# EAGLE design McPiFace-60mmFan-V2 (EAGLE 7.4.0)
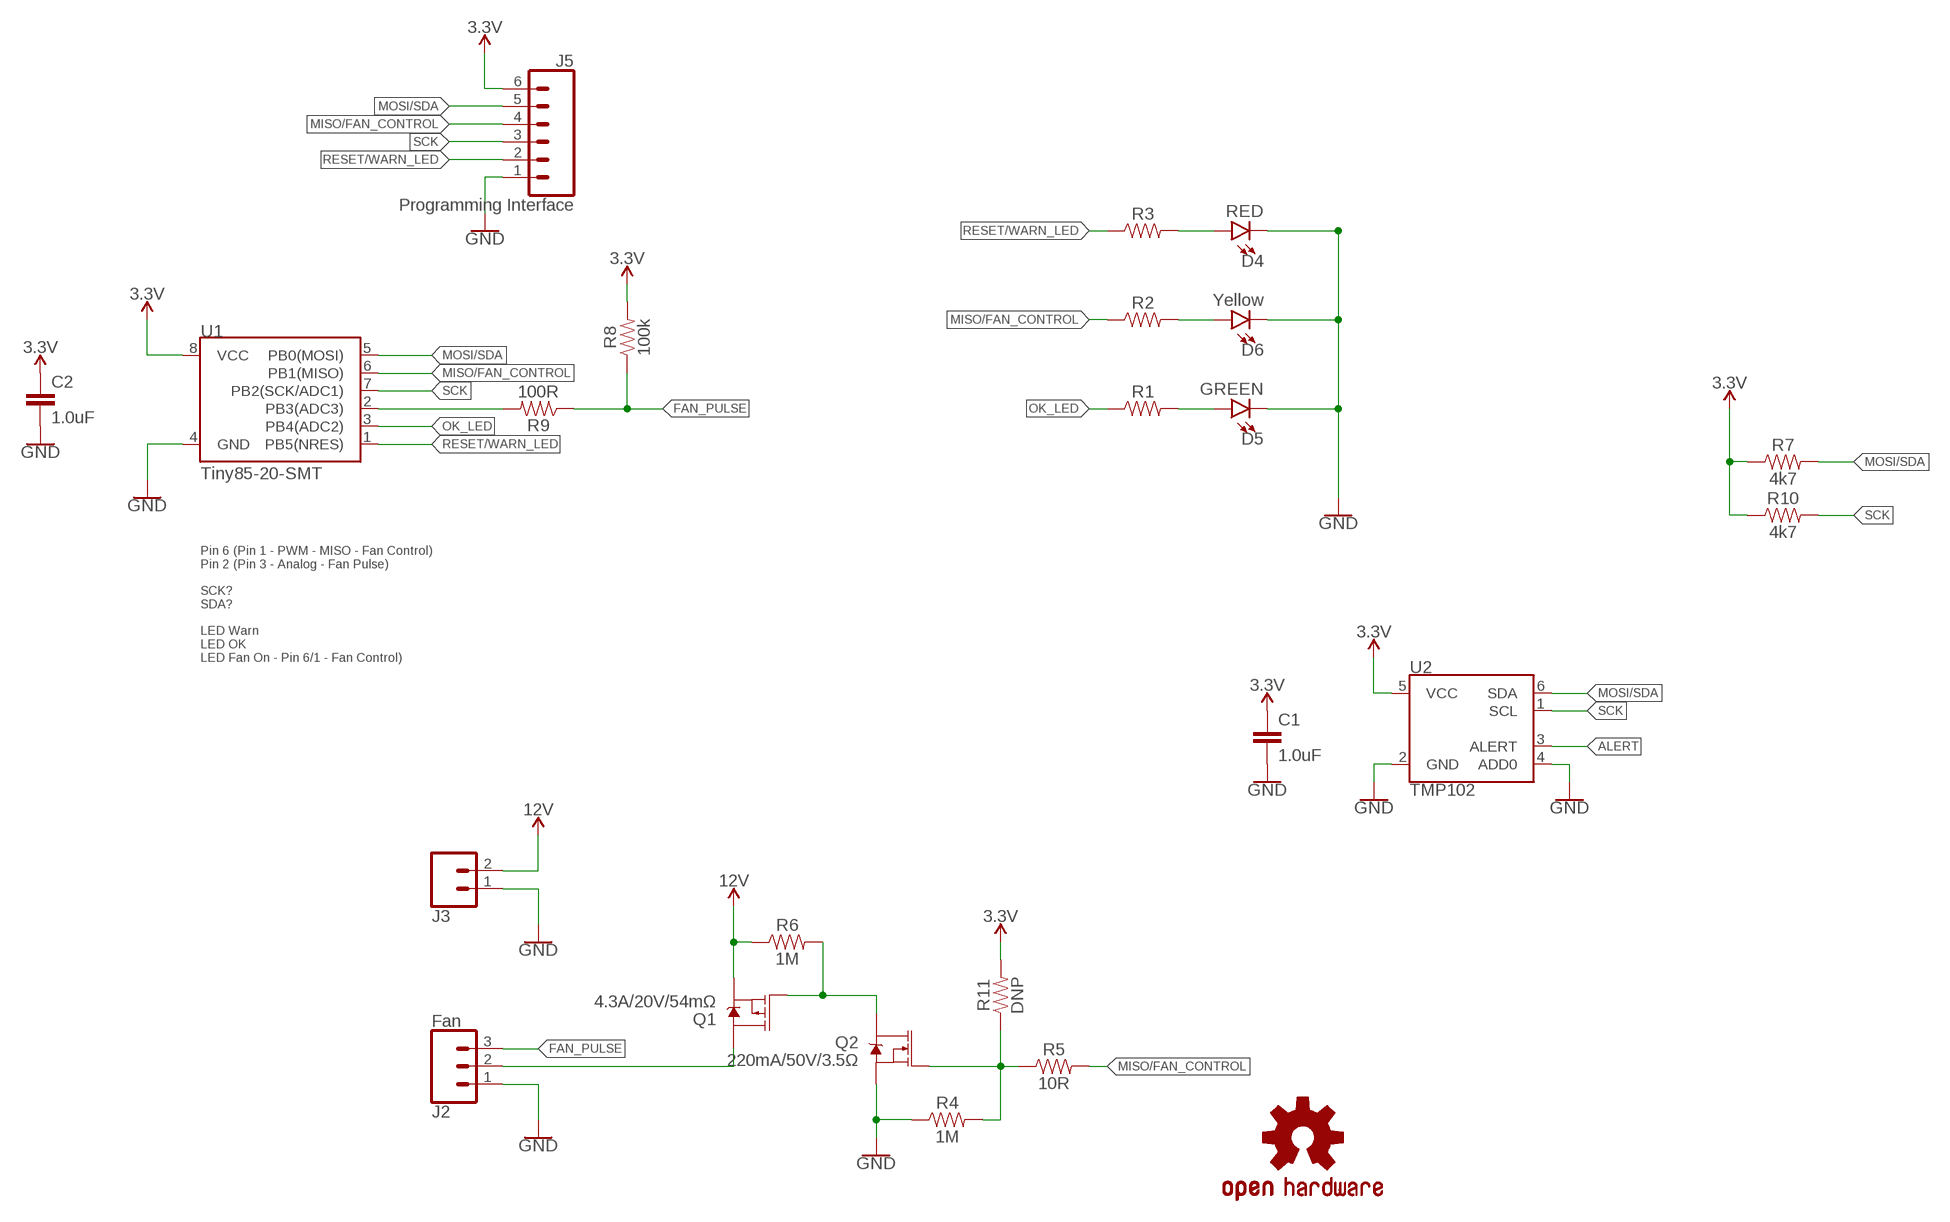
[diagram p0: schematic, sheet 1]

## Parts
C1  1.0uF  1.0UF-0805-25V-10%  [0805]
C2  1.0uF  1.0UF-0805-25V-10%  [0805]
D4  RED  LED-RED1206  [LED-1206]
D5  GREEN  LED-GREEN1206  [LED-1206]
D6  Yellow  LED-YELLOWLILYPAD  [LED-1206]
J2  Fan  CONN_03JST-SMD  [JST-3-SMD]
J3  CONN_02-JST-2MM-SMT  [JST-2-SMD]
J5  Programming Interface  CONN_06SMD-1MM  [1X06-1MM]
LOGO1  OSHW-LOGOL  [OSHW-LOGO-L]
Q1  4.3A/20V/54mΩ  MOSFET_PCH-IRLML2244  [SOT23-3]
Q2  220mA/50V/3.5Ω  MOSFET-NCH-BSS138  [SOT23-3]
R1  RESISTOR1206  [1206]
R2  RESISTOR1206  [1206]
R3  RESISTOR1206  [1206]
R4  1M  RESISTOR0805  [0805]
R5  10R  RESISTOR0805  [0805]
R6  1M  RESISTOR0805  [0805]
R7  4k7  RESISTOR0805  [0805]
R8  100k  RESISTOR0805  [0805]
R9  100R  RESISTOR0805  [0805]
R10  4k7  RESISTOR0805  [0805]
R11  DNP  RESISTOR0805  [0805]
U1  Tiny85-20-SMT  ATTINY45TINY85-20-SMT  [SO08-EIAJ]
U2  TMP102  [SOT563]

## Nets
3.3V: C1.1 C2.1 J5.6 R7.1 R8.2 R10.1 R11.2 U1.8(VCC) U2.5(VCC)
12V: J3.2 Q1.2(S) R6.1
ALERT: U2.3(ALERT)
FAN_PULSE: J2.3 R8.1 R9.1
GND: C1.2 C2.2 D4.C D5.C D6.C J2.1 J3.1 J5.1 Q2.2(S) R4.1 U1.4(GND) U2.2(GND) U2.4(ADD0)
MISO/FAN_CONTROL: J5.4 R2.1 R5.2 U1.6(PB1(MISO))
MOSI/SDA: J5.5 R7.2 U1.5(PB0(MOSI)) U2.6(SDA)
N$1: R9.2 U1.2(PB3(ADC3))
N$2: D4.A R3.2
N$3: D6.A R2.2
N$4: D5.A R1.2
N$8: J2.2 Q1.3(D)
N$10: Q1.1(G) Q2.3(D) R6.2
N$11: Q2.1(G) R4.2 R5.1 R11.1
OK_LED: R1.1 U1.3(PB4(ADC2))
RESET/WARN_LED: J5.2 R3.1 U1.1(PB5(NRES))
SCK: J5.3 R10.2 U1.7(PB2(SCK/ADC1)) U2.1(SCL)

## Notes on the sheet
- Pin 6 (Pin 1 - PWM - MISO - Fan Control)
  Pin 2 (Pin 3 - Analog - Fan Pulse)
  
  SCK?
  SDA?
  
  LED Warn
  LED OK
  LED Fan On - Pin 6/1 - Fan Control)

## Library data of the parts
C1 C2 = SparkFun-Capacitors:1.0UF: 1µF ceramic capacitors A capacitor is a passive two-terminal electrical component used to store electrical energy temporarily in an electric field.; PROD_ID: CAP-08064
D4 = SparkFun-LED:LED-RED: Red SMD LED Used in manufacturing of most products at SparkFun Packages: 0603 - SMD 0603 package [Product Link] <http://docs.avagotech.com/docs/AV02-0551EN> 0603 SMART - SMD 0603 SMART package ( more efficient and expensive)[Product Link] <http://www.osram-os.com/Graphics/XPic2/00077099_0.pdf> 1206 - SMD1206 package [Product Link] <https://www.sparkfun.com/datasheets/DevTools/LilyPad/Q150OVS4.pdff> SparkFun Products: Pro Mini 328 -5V <https://www.sparkfun.com/products/821> RedBoard <https://www.sparkfun.com/products/12757> IOIO-OTG <https://www.sparkfun.com/products/13613>; PROD_ID: DIO-09912
D5 = SparkFun-LED:LED-GREEN: Green SMD LED Used in manufacturing of various products at SparkFun Packages: 0603 - SMD 0603 package [Product Link] <http://www.futureelectronics.com/en/technologies/semiconductors/optoelectronics/leds/Pages/9894312-LTST-C190GKT.aspx?CrossPart=HSMG-C190&IM=0> LilyPad 1206 - SMD1206 LilyPad package [Product Link] <http://www.futureelectronics.com/en/Technologies/Product.aspx?ProductID=IN150NGHARVATEKCORPORATION2049943&IM=0> 1206 - SMD1206 package [Product Link] <http://www.futureelectronics.com/en/technologies/semiconductors/optoelectronics/leds/Pages/8315665-LTST-C150KGKT.aspx?IM=0> 1206 Bottom Mount -SMD 1206 Bottom Mount [Product Link] <http://www.digikey.com/product-detail/en/lite-on-inc/LTST-C230KGKT/160-1456-1-ND/386854> SparkFun Products: Pro Mini 328 -5V <https://www.sparkfun.com/products/821> RedBoard <https://www.sparkfun.com/products/12757> MP3 Trigger <https://www.sparkfun.com/products/13720> Makey Makey <https://www.sparkfun.com/products/11076>; PROD_ID: DIO-00862
D6 = SparkFun-LED:LED-YELLOW: Yellow SMD LED Used in manufacturing several products at SparkFun. Packages: 0603 - SMD 0603 package[Product Link] <http://www.kingbrightusa.com/product.asp?catalog_name=LED&product_id=APT1608SYCK> 0603 -SMART - SMART SMD 0603 package (more efficient/more expensive) [Product Link] <http://www.osram-os.com/osram_os/en/products/product-catalog/led-light-emitting-diodes/smartled-0603/ly-l29k/index.jsp> LilyPad - SMD1206 package[Product Datasheet] <https://www.sparkfun.com/datasheets/DevTools/LilyPad/Q150YUS4.pdf> SparkFun Products: Blynk Board <https://www.sparkfun.com/products/13794> IOIO-OTG <https://www.sparkfun.com/products/13613> XBee Explorer Serial <https://www.sparkfun.com/products/13225>; PROD_ID: DIO-09909
J2 = SparkFun-Connectors:CONN_03: Multi connection point. Often used as Generic Header-pin footprint for 0.1 inch spaced/style header connections On any of the 0.1 inch spaced packages, you can populate with these: Break Away Headers - Straight <https://www.sparkfun.com/products/116> (PRT-00116) Break Away Male Headers - Right Angle <https://www.sparkfun.com/products/553> (PRT-00553) Female Headers <https://www.sparkfun.com/products/115> (PRT-00115) Break Away Headers - Machine Pin <https://www.sparkfun.com/products/117> (PRT-00117) Break Away Female Headers - Swiss Machine Pin <https://www.sparkfun.com/products/743> (PRT-00743) Stackable Header - 3 Pin (Female, 0.1") <https://www.sparkfun.com/products/13875> (PRT-13875) For SCREWTERMINALS and SPRING TERMINALS visit here: Screw Terimnals on SparkFun.com <https://www.sparkfun.com/search/results?term=Screw+Terminals> (5mm/3.5mm/2.54mm spacing) This device is also useful as a general connection point to wire up your design to another part of your project. Our various solder wires solder well into these plated through hole pads. Hook-Up Wire - Assortment (Stranded, 22 AWG) <https://www.sparkfun.com/products/11375> (PRT-11375) Hook-Up Wire - Assortment (Solid Core, 22 AWG) <https://www.sparkfun.com/products/11367> (PRT-11367) View the entire wire category on our website here <https://www.sparkfun.com/categories/141> Special notes: Molex polarized connector foot print use with SKU : PRT-08232 with associated crimp pins and housings.; FARNELL: 9492623; MFG: S3B-PH-SM4-TB(LF)(SN); PROD_ID: CONN-12591; VALUE: 3-PIN SMD
J3 = SparkFun-Connectors:CONN_02: Multi connection point. Often used as Generic Header-pin footprint for 0.1 inch spaced/style header connections On any of the 0.1 inch spaced packages, you can populate with these: Break Away Headers - Straight <https://www.sparkfun.com/products/116> (PRT-00116) Break Away Male Headers - Right Angle <https://www.sparkfun.com/products/553> (PRT-00553) Female Headers <https://www.sparkfun.com/products/115> (PRT-00115) Break Away Headers - Machine Pin <https://www.sparkfun.com/products/117> (PRT-00117) Break Away Female Headers - Swiss Machine Pin <https://www.sparkfun.com/products/743> (PRT-00743) For SCREWTERMINALS and SPRING TERMINALS visit here: Screw Terimnals on SparkFun.com <https://www.sparkfun.com/search/results?term=Screw+Terminals> (5mm/3.5mm/2.54mm spacing) This device is also useful as a general connection point to wire up your design to another part of your project. Our various solder wires solder well into these plated through hole pads. Hook-Up Wire - Assortment (Stranded, 22 AWG) <https://www.sparkfun.com/products/11375> (PRT-11375) Hook-Up Wire - Assortment (Solid Core, 22 AWG) <https://www.sparkfun.com/products/11367> (PRT-11367) View the entire wire category on our website here <https://www.sparkfun.com/categories/141> Special notes: Molex polarized connector foot print use with: PRT-08233 with associated crimp pins and housings. 2.54_SCREWTERM for use with PRT-10571. 3.5mm Screw Terminal footprints for PRT-08084 5mm Screw Terminal footprints for use with PRT-08432; FARNELL: 9492615; MFG: S2B-PH-SM4-TB(LF)(SN); PROD_ID: CONN-11443
J5 = SparkFun-Connectors:CONN_06: Multi connection point. Often used as Generic Header-pin footprint for 0.1 inch spaced/style header connections On any of the 0.1 inch spaced packages, you can populate with these: Break Away Headers - Straight <https://www.sparkfun.com/products/116> (PRT-00116) Break Away Male Headers - Right Angle <https://www.sparkfun.com/products/553> (PRT-00553) Female Headers <https://www.sparkfun.com/products/115> (PRT-00115) Break Away Headers - Machine Pin <https://www.sparkfun.com/products/117> (PRT-00117) Break Away Female Headers - Swiss Machine Pin <https://www.sparkfun.com/products/743> (PRT-00743) Arduino Stackable Header - 6 Pin <https://www.sparkfun.com/products/9280> (PRT-09280) For SCREWTERMINALS and SPRING TERMINALS visit here: Screw Terimnals on SparkFun.com <https://www.sparkfun.com/search/results?term=Screw+Terminals> (5mm/3.5mm/2.54mm spacing) This device is also useful as a general connection point to wire up your design to another part of your project. Our various solder wires solder well into these plated through hole pads. Hook-Up Wire - Assortment (Stranded, 22 AWG) <https://www.sparkfun.com/products/11375> (PRT-11375) Hook-Up Wire - Assortment (Solid Core, 22 AWG) <https://www.sparkfun.com/products/11367> (PRT-11367) View the entire wire category on our website here <https://www.sparkfun.com/categories/141>; PROD_ID: CONN-08249; SF_ID: GPS-00579
LOGO1 = SparkFun-Aesthetics:OSHW-LOGO: Open-Source Hardware (OSHW) Logo This logo indicates the piece of hardware it is found on incorporates a OSHW license and/or adheres to the definition of open source hardware found here: http://freedomdefined.org/OSHW
Q1 = SparkFun-DiscreteSemi:MOSFET_PCH: P-channel MOSFETs Voltage controlled devices that allow control of high current outputs. SparkFun Products: SparkFun ESP32 Thing <https://www.sparkfun.com/products/13907> SparkFun ESP8266 Thing <https://www.sparkfun.com/products/13231>; PROD_ID: TRANS-11153
Q2 = SparkFun-DiscreteSemi:MOSFET-NCH: N-channel MOSFETs Voltage controlled devices that allow control of high current outputs. SparkFun Products: SparkFun OpenScale <https://www.sparkfun.com/products/13261> SparkFun Digital Sandbox <https://www.sparkfun.com/products/12651> SparkFun Monster Moto Shield <https://www.sparkfun.com/products/10182> SparkFun MOSFET Power Controller <https://www.sparkfun.com/products/11214>; PROD_ID: TRANS-00830
R1-R11 = SparkFun-Resistors:RESISTOR: Generic Resistor Package
U1 = SparkFun-DigitalIC:ATTINY45: Atmel 8-pin 2/4/8kB flash uC; PROD_ID: IC-09092
U2 = SparkFun-Sensors:TMP102: Texas Instruments TMP102 Low-Power Digital Temperature Sensor The TMP102 is a digital sensor (I2C a.k.a. TWI), has a resolution of 0.0625°C, and is accurate up to 0.5°C. This is a very handy sensor that requires a very low-current. Datasheet <http://www.sparkfun.com/datasheets/Sensors/Temperature/tmp102.pdf> SparkFun Products SparkFun Digital Temperature Sensor Breakout - TMP102 <https://www.sparkfun.com/products/11931> (SEN-11931); PROD_ID: IC-09303

## Board
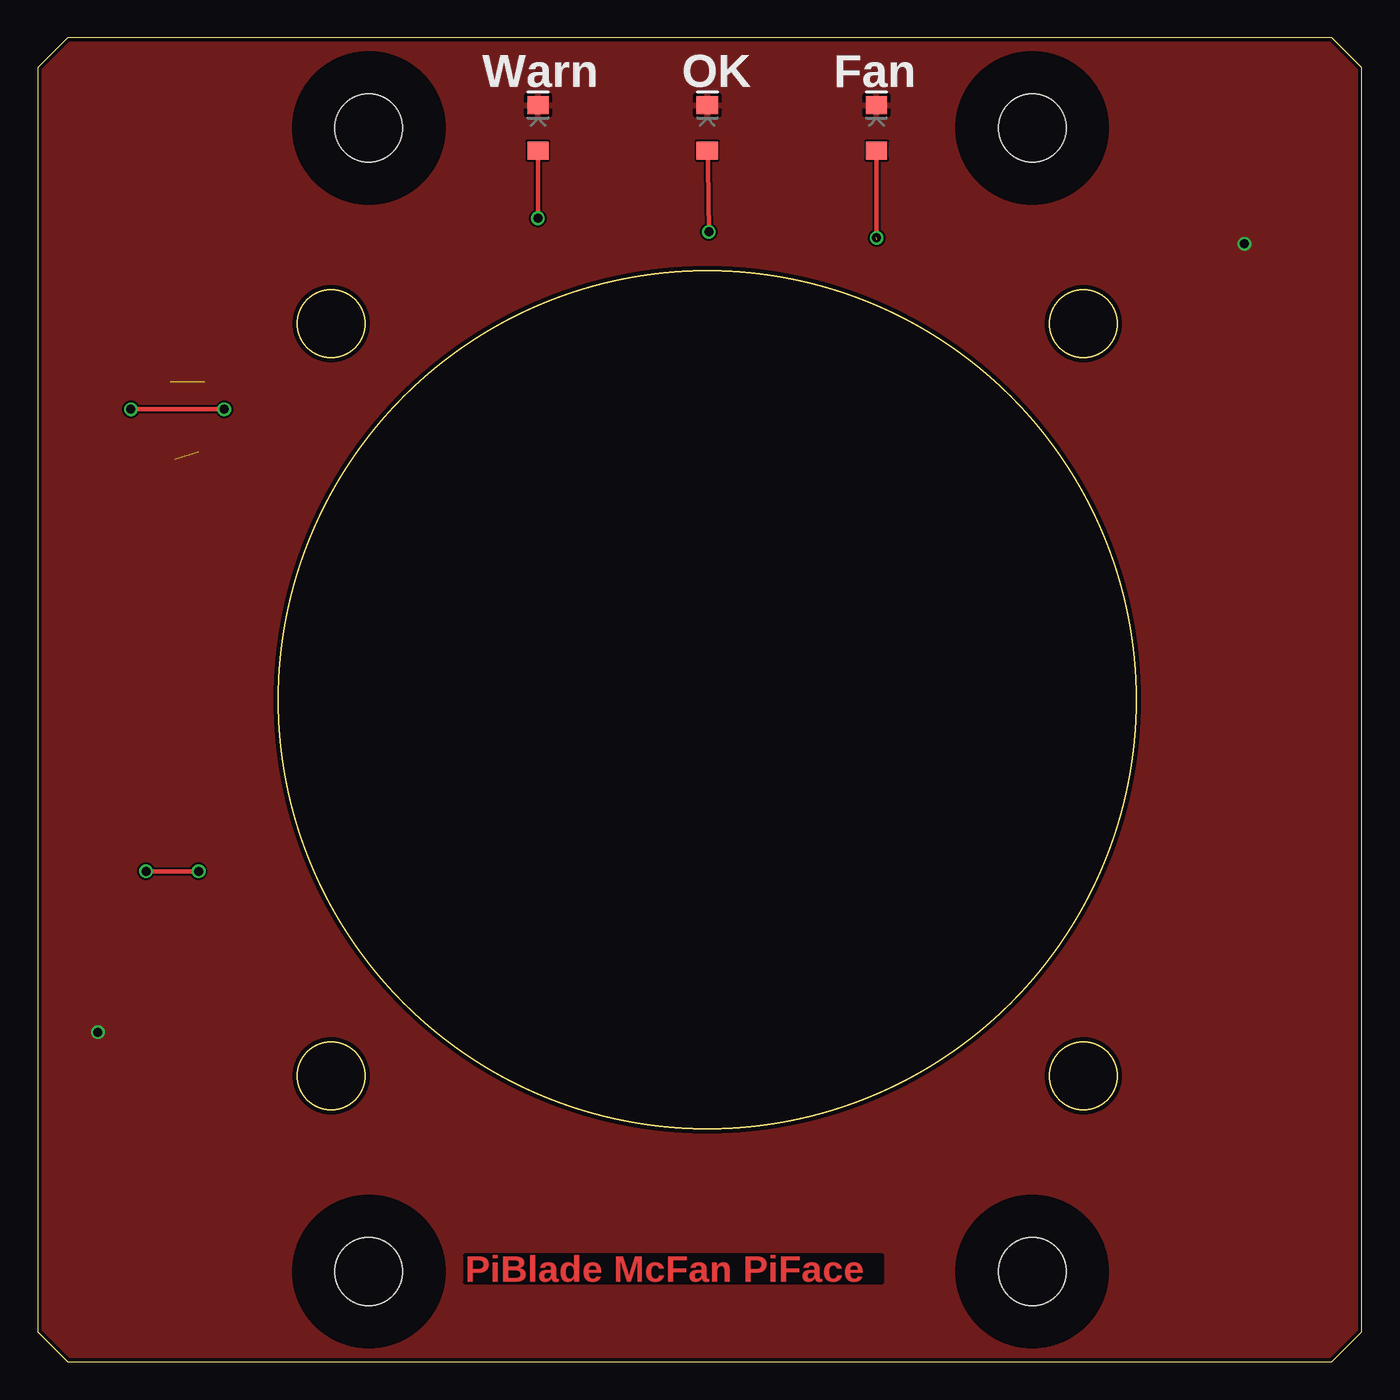
[diagram p1: board, top side]
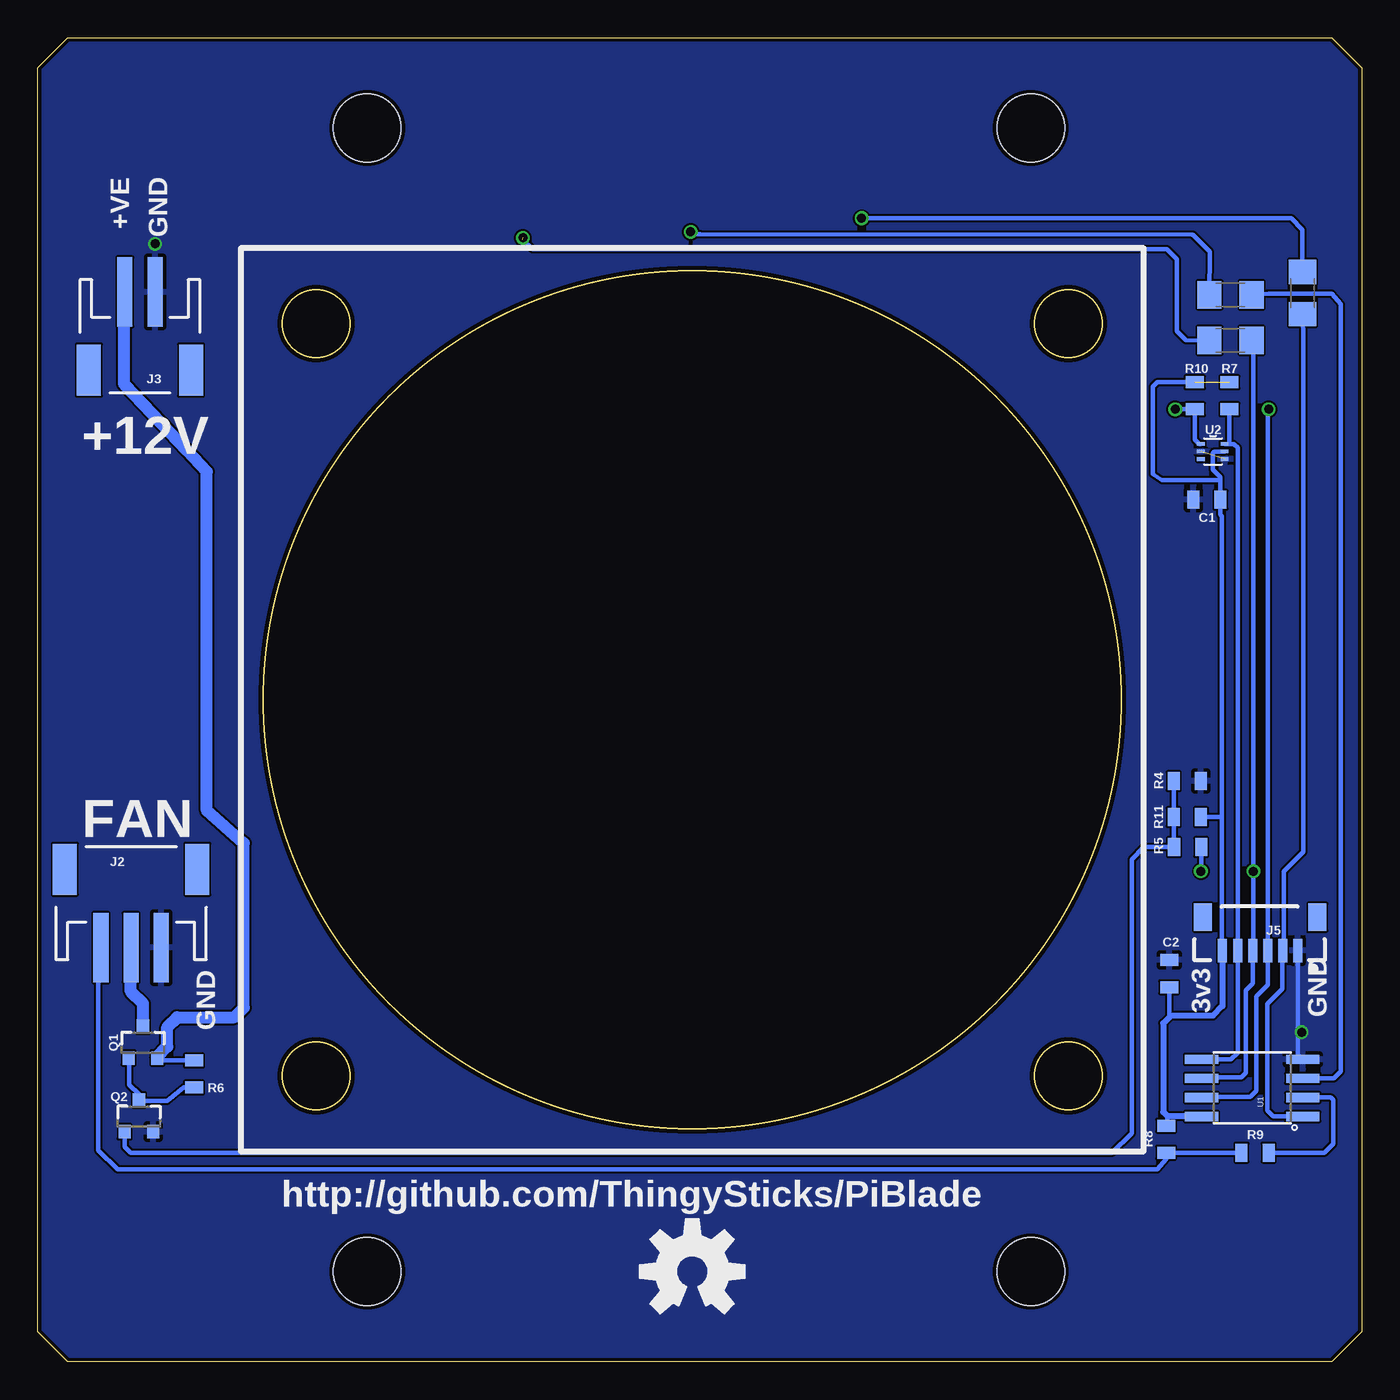
[diagram p2: board, bottom side, seen from below]

Size 88 x 88 mm. Coordinates in mm from the lower left corner, seen from the top.
Outline: 2,0 86,0 88,2 88,86 86,88 2,88 0,86 0,2 2,0
Outline: circle at 44.5,44 radius 28.5
Outline: circle at 19.5,69 radius 2.25
Outline: circle at 69.5,69 radius 2.25
Outline: circle at 69.5,19 radius 2.25
Outline: circle at 19.5,19 radius 2.25
Copper layers (1*16): Top 0.035mm / dielectric 1.5mm / Bottom 0.035mm
Design rules "dirt_cheap_dirty_boards.v1": minimum track width 5mil, minimum drill 12mil, track to track 5mil, track to pad 5mil, pad to pad 5mil, via to via 5mil, smd to smd 0mil, copper to edge 10mil, drill to drill 10mil, minimum pad ring 10mil, minimum via ring 6mil, stop-mask expansion 2mil, vias tented up to drill 25mil, thermal gap 10mil
Holes 4.5 mm at 22,6 22,82 66.1,82 66.1,6
tRestrict: area 17,77 to 27,87; area 17,1 to 27,11; area 61.1,1 to 71.1,11; area 61.1,77 to 71.1,87

### Footprints (pad centres in the part's own frame; a part is rotated, then mirrored left to right if it is on the bottom)
0805 = smd 0.8 x 1.2: 1 -0.9,0; 2 0.9,0
LED-1206 = smd 1.2 x 1.4: A -1.5,0; C 1.5,0
JST-3-SMD = smd 1 x 4.6: 1 2.01,-4.77; 2 0.01,-4.77; 3 -1.99,-4.77 | smd 1.6 x 3.4: NC1 -4.39,0.43; NC2 4.41,0.43
JST-2-SMD = smd 1 x 4.6: 1 -1,-3.7; 2 1,-3.7 | smd 1.6 x 3.4: NC1 -3.4,1.5; NC2 3.4,1.5
1X06-1MM = smd 0.6 x 1.55: 1 -2.54,1.27; 2 -1.54,1.27; 3 -0.54,1.27; 4 0.46,1.27; 5 1.46,1.27; 6 2.46,1.27 | smd 1.2 x 1.8: P$1 -3.84,-0.955; P$2 3.76,-0.955
SOT23-3 = smd 0.8 x 0.9: 1 -0.95,-1; 2 0.95,-1; 3 0,1.1
1206 = smd 1.6 x 1.8: 1 -1.4,0; 2 1.4,0
SO08-EIAJ = smd 0.61 x 2.21: 1 -1.905,-3.378; 2 -0.635,-3.378; 3 0.635,-3.378; 4 1.905,-3.378; 5 1.905,3.353; 6 0.635,3.353; 7 -0.635,3.353; 8 -1.905,3.353
SOT563 = smd 0.508 x 0.249: 1 -0.8,0.498; 2 -0.8,0.003; 3 -0.8,-0.506; 4 0.776,-0.506; 5 0.776,0.003; 6 0.776,0.498

### Placement (x,y rotation side)
C1  10.3,57.3 180 bottom
C2  12.8,25.8 90 bottom
D4  33.25,82 90 top
D5  44.5,82 90 top
D6  55.75,82 90 top
J2  81.8,32.3 0 bottom
J3  81.2,67.4 180 bottom
J5  6.8,28.6 180 bottom
LOGO1  44.5,6 0 bottom
Q1  81,21.2 0 bottom
Q2  81.27,16.3 0 bottom
R1  8.73,70.91 180 bottom
R2  8.73,67.88 180 bottom
R3  3.94,71.03 90 bottom
R4  11.6,38.59 180 bottom
R5  11.58,34.2 0 bottom
R6  77.6,19.13 270 bottom
R7  8.8,64.2 270 bottom
R8  13,14.8 90 bottom
R9  7.1,13.9 0 bottom
R10  11.1,64.2 270 bottom
R11  11.6,36.2 0 bottom
U1  7.3,18.2 90 bottom
U2  9.9,60.5 0 bottom

### Tracks (layer width: path | path; a pad name or v marks a point on that pad's centre or on a via)
3.3V  (1 unrouted)
  Bottom 0.305: R8.2 12.9,16.3 | U1.8 | C2.1 12.8,23.1 12.7,23 | 9.32,36.2 9.3,53.6 9.3,56.2 9.4,56.3 C1.1 9.4,58.5 | 9.32,36.2 9.32,32 9.3,27.37 J5.6 | U2.5 9.8,60.5 9.9,60.4 9.9,59.3 9.4,58.8 9.4,58.5 | R11.2 9.32,36.2 | R10.1 13.6,65.1 13.9,64.8 13.9,59 13.3,58.6 9.5,58.6 9.4,58.5
  Bottom 0.406: J5.6 9.26,23.64 9.9,23 12.7,23 13.2,22.5 13.2,16.6 12.9,16.3 U1.8
12V
  Bottom 0.305: R6.1 79.88,20.03 Q1.2
  Bottom 0.813: Q1.2 80.05,20.28 79.38,20.95 79.38,22.26 78.74,22.89 74.93,22.89 74.3,23.53 74.3,34.46 76.77,36.63 76.77,59.16 78.03,60.52 82.18,64.92 82.25,65 82.25,70.75 J3.2
FAN_PULSE
  Bottom 0.305: 83.69,27.43 J2.3 83.96,27.36 83.96,14.06 82.69,12.79 13.6,12.8 13.01,13.49 R8.1 R9.1
GND  (via drill 0.6)  (1 unrouted)
  Bottom 0.305: J5.1 4.26,20.44 U1.4
  other vias: 4,21.9 80.2,74.3
  pour Top: -1,88.5 88.7,88.5 88.7,-1 -1,-1
  pour Bottom: -1,88.5 88.7,88.5 88.7,-1 -1,-1
MISO/FAN_CONTROL  (via drill 0.6)
  Top 0.305: v10.7,32.6 v7.2,32.6
  Bottom 0.305: U1.6 10.59,18.9 8,18.9 7.7,19.2 7.7,24.7 7.26,25.14 J5.4 7.2,27.39 v7.2,32.6 7.2,66.8 7.3,67.7 7.22,67.82 R2.1 | R5.2 10.68,32.92 v10.7,32.6
MOSI/SDA
  Bottom 0.305: U1.5 8.7,20.1 8.26,20.54 J5.5 8.26,60.76 8.5,61 8.82,61 U2.6 8.8,61.02 R7.2
N$1
  Bottom 0.305: U1.2 2.06,17.57 1.9,17.4 1.9,14.5 2.5,13.9 R9.2
N$2  (via drill 0.6)
  Top 0.305: v33.25,76 33.24,79.94 D4.A
  Bottom 0.305: R3.2 3.94,75.25 4.7,76 33.2,76 33.3,76.15 v33.25,76
N$3  (via drill 0.6)  (1 unrouted)
  Top 0.305: v55.75,74.7 D6.A
  Bottom 0.305: 55.76,74.56 55.12,73.93 12.96,73.93 12.3,73.28 12.3,68.5 11.7,67.9 10.42,67.86 R2.2
N$4  (via drill 0.6)
  Top 0.305: v44.6,75.1 44.55,79.45 D5.A
  Bottom 0.305: R1.2 10.1,73.7 10.1,73.78 11.22,74.9 11.3,74.9 43.95,74.93 44.55,74.94 v44.6,75.1
N$8
  Bottom 0.813: Q1.3 81,23.8 81.8,24.6 J2.2
N$10
  Bottom 0.305: Q1.1 81.92,20.16 81.92,18.41 81.27,17.77 Q2.3 81.22,17.34 79.38,17.34 78.29,18.23 R6.2
N$11
  Bottom 0.305: Q2.1 82.2,14.98 82.2,14.3 81.8,13.9 16.6,13.9 15.3,15.2 15.3,33.4 14.49,34.2 R5.1 12.5,34.23 R11.1 R4.2
OK_LED
  Bottom 0.305: U1.3 1.86,18.84 1.4,19.3 1.4,70.3 2,71 6.2,71 7.1,70.94 R1.1
RESET/WARN_LED
  Bottom 0.305: U1.1 5.9,16.3 6.3,16.7 6.3,23.8 5.3,24.8 5.3,27.29 J5.2 5.2,27.39 5.2,32.6 3.9,33.9 3.9,68.47 R3.1
SCK  (via drill 0.6)
  Top 0.305: v6.2,63.3 v12.4,63.3
  Bottom 0.305: U1.7 10.62,17.6 7.4,17.6 7,18 7,24.3 6.26,25.04 J5.3 6.26,62.94 v6.2,63.3 | U2.1 10.8,61 11.1,61.3 R10.2 v12.4,63.3

### Text on the board
Top: PiBlade McFan PiFace
tNames: Warn | OK | Fan
bNames: GND | +VE | +12V | FAN | GND | GND | 3v3 | http://github.com/ThingySticks/PiBlade